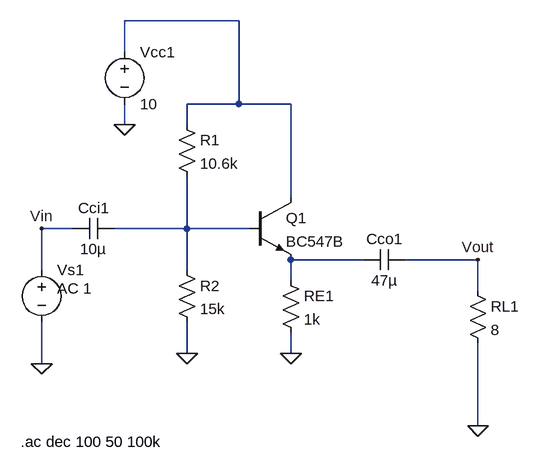
[diagram p0: schematic lab7.2e.asc]
lab7.2e.asc, the LTspice schematic file:
Version 4
SHEET 1 880 680
WIRE 192 -208 16 -208
WIRE 16 -160 16 -208
WIRE 192 -80 192 -208
WIRE 192 -80 112 -80
WIRE 272 -80 192 -80
WIRE 16 -48 16 -80
WIRE 112 -48 112 -80
WIRE 272 64 272 -80
WIRE -64 112 -112 112
WIRE 112 112 112 32
WIRE 112 112 0 112
WIRE 208 112 112 112
WIRE 384 160 272 160
WIRE 560 160 448 160
WIRE -112 176 -112 112
WIRE 112 176 112 112
WIRE 272 192 272 160
WIRE 560 208 560 160
WIRE 112 304 112 256
WIRE 272 304 272 272
WIRE -112 320 -112 256
WIRE 560 416 560 288
FLAG -112 320 0
FLAG 112 304 0
FLAG 272 304 0
FLAG 560 416 0
FLAG 16 -48 0
FLAG 560 160 Vout
FLAG -112 112 Vin
SYMBOL voltage -112 160 R0
WINDOW 123 24 44 Left 2
WINDOW 39 0 0 Left 0
WINDOW 3 24 44 Left 2
SYMATTR Value2 AC 1
SYMATTR Value ""
SYMATTR InstName Vs1
SYMBOL res 96 -64 R0
SYMATTR InstName R1
SYMATTR Value 10.6k
SYMBOL res 96 160 R0
SYMATTR InstName R2
SYMATTR Value 15k
SYMBOL res 256 176 R0
SYMATTR InstName RE1
SYMATTR Value 1k
SYMBOL cap 448 144 R90
WINDOW 0 0 32 VBottom 2
WINDOW 3 32 32 VTop 2
SYMATTR InstName Cco1
SYMATTR Value 47µ
SYMBOL res 544 192 R0
SYMATTR InstName RL1
SYMATTR Value 8
SYMBOL npn 208 64 R0
SYMATTR InstName Q1
SYMATTR Value BC547B
SYMBOL voltage 16 -176 R0
SYMATTR InstName Vcc1
SYMATTR Value 10
SYMBOL cap 0 96 R90
WINDOW 0 0 32 VBottom 2
WINDOW 3 32 32 VTop 2
SYMATTR InstName Cci1
SYMATTR Value 10µ
TEXT -144 440 Left 2 !.ac dec 100 50 100k

The netlist it stands for:
* lab7.2e.asc
Vs1 Vin 0 AC 1
R1 N001 N002 10.6k
R2 N002 0 15k
RE1 N003 0 1k
Cco1 Vout N003 47µ
RL1 Vout 0 8
Q1 N001 N002 N003 0 BC547B
Vcc1 N001 0 10
Cci1 N002 Vin 10µ
.model NPN NPN
.model PNP PNP
.lib standard.bjt
.ac dec 100 50 100k
.backanno
.end